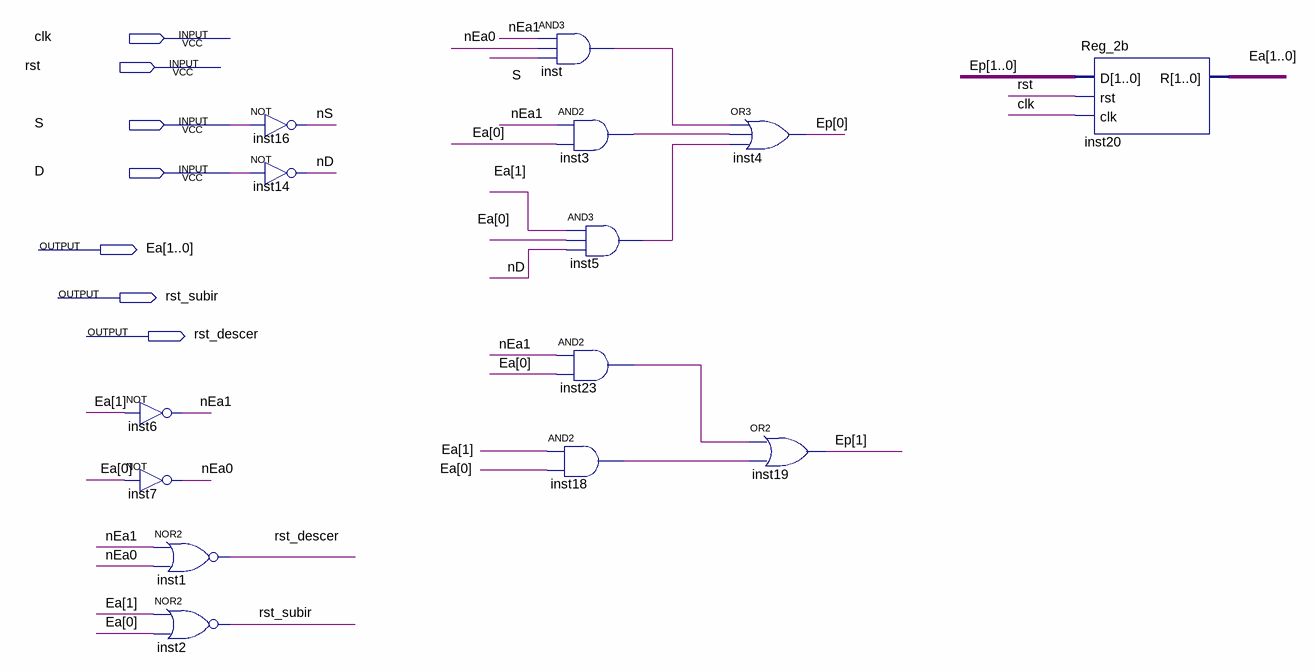
[diagram p0: schematic sheet]
// Quartus schematic Controle.bdf as structural Verilog: 14 symbols, 7 pins
module Controle (
  input  clk,
  input  rst,
  input  S,
  input  D,
  output [1:0] Ea,
  output rst_subir,
  output rst_descer
);

  wire inst3_out, inst5_out, inst18_out, inst23_out, inst_out, nD, nEa0, nEa1, nS;
  wire [1:0] Ep;

  not inst6 (nEa1, Ea[1]);
  not inst7 (nEa0, Ea[0]);
  nor inst1 (rst_descer, nEa1, nEa0);
  nor inst2 (rst_subir, Ea[1], Ea[0]);
  not inst16 (nS, S);
  not inst14 (nD, D);
  and inst (inst_out, nEa1, nEa0, S);
  and inst3 (inst3_out, nEa1, Ea[0]);
  and inst5 (inst5_out, Ea[1], Ea[0], nD);
  and inst23 (inst23_out, nEa1, Ea[0]);
  and inst18 (inst18_out, Ea[1], Ea[0]);
  or inst4 (Ep[0], inst_out, inst3_out, inst5_out);
  or inst19 (Ep[1], inst23_out, inst18_out);
  Reg_2b inst20 (.D(Ep), .rst(rst), .clk(clk), .R(Ea));
endmodule
